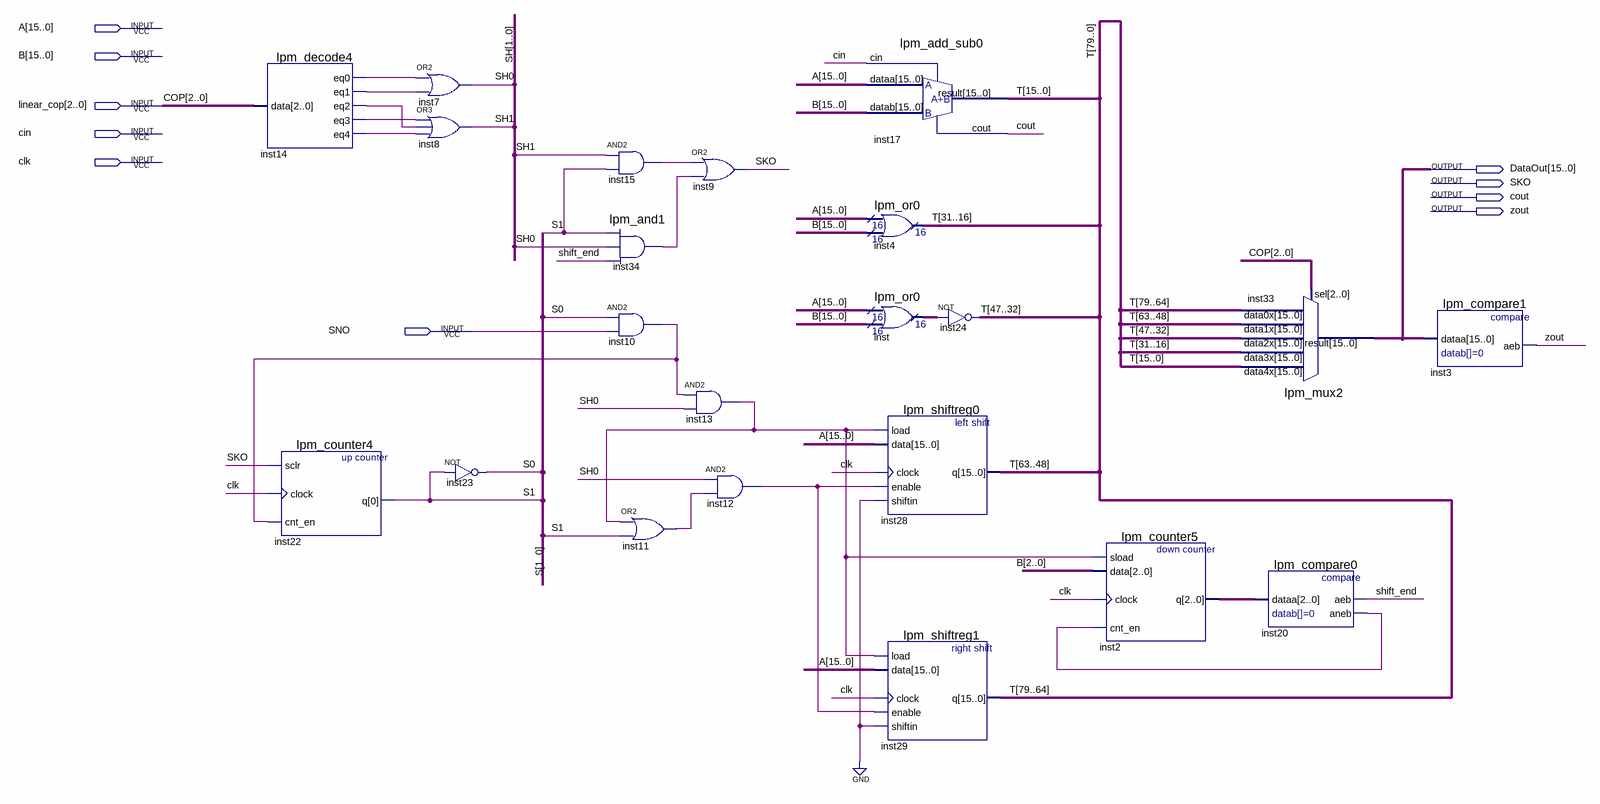
[diagram p0: schematic sheet]
// Quartus schematic ALU.bdf as structural Verilog: 22 symbols, 10 pins
module ALU (
  input  [15:0] A,
  input  [15:0] B,
  input  [2:0] linear_cop,
  input  cin,
  input  clk,
  input  SNO,
  output [15:0] DataOut,
  output SKO,
  output cout,
  output zout
);

  wire inst10_out, inst11_out, inst12_out, inst13_out, inst14_eq0, inst14_eq1, inst14_eq2, inst14_eq3,
       inst14_eq4, inst15_out, inst20_aneb, inst34_result, shift_end;
  wire [1:0] S, SH;
  wire [2:0] inst2_q;
  wire [15:0] inst_result;
  wire [79:0] T;

  lpm_decode4 inst14 (
    .data(linear_cop), .eq0(inst14_eq0), .eq1(inst14_eq1), .eq2(inst14_eq2), .eq3(inst14_eq3),
    .eq4(inst14_eq4));
  lpm_counter4 inst22 (.sclr(SKO), .clock(clk), .cnt_en(inst10_out), .q(S[1]));
  or inst7 (SH[0], inst14_eq0, inst14_eq1);
  or inst8 (SH[1], inst14_eq3, inst14_eq2, inst14_eq4);
  not inst23 (S[0], S[1]);
  and inst15 (inst15_out, SH[1], S[1]);
  lpm_and1 inst34 (.data0(S[1]), .data1(SH[0]), .data2(shift_end), .result(inst34_result));
  and inst10 (inst10_out, S[0], SNO);
  or inst11 (inst11_out, inst13_out, S[1]);
  or inst9 (SKO, inst15_out, inst34_result);
  and inst13 (inst13_out, inst10_out, SH[0]);
  and inst12 (inst12_out, SH[0], inst11_out);
  lpm_add_sub0 inst17 (.dataa(A), .datab(B), .cin(cin), .result(T[15:0]), .cout(cout));
  lpm_or0 inst4 (.data0x(A), .data1x(B), .result(T[31:16]));
  lpm_or0 inst (.data0x(A), .data1x(B), .result(inst_result));
  lpm_shiftreg0 inst28 (.load(inst13_out), .data(A), .clock(clk), .enable(inst12_out), .shiftin(1'b0), .q(T[63:48]));
  lpm_shiftreg1 inst29 (.load(inst13_out), .data(A), .clock(clk), .enable(inst12_out), .shiftin(1'b0), .q(T[79:64]));
  assign T[47:32] = ~inst_result;  // NOT inst24, 16 bits wide
  lpm_counter5 inst2 (.sload(inst13_out), .data(B[2:0]), .clock(clk), .cnt_en(inst20_aneb), .q(inst2_q));
  lpm_mux2 inst33 (
    .data4x(T[15:0]), .data3x(T[31:16]), .data2x(T[47:32]), .data1x(T[63:48]), .data0x(T[79:64]),
    .sel(linear_cop), .result(DataOut));
  lpm_compare0 inst20 (.dataa(inst2_q), .aeb(shift_end), .aneb(inst20_aneb));
  lpm_compare1 inst3 (.dataa(DataOut), .aeb(zout));

  // Other names for the same wires on the sheet: COP[2:0] = linear_cop
endmodule
